# Altium schematic sheet IDE_Terminator.SchDoc: IDE Terminator
size A4; Revision: 5; SheetNumber: 3; SheetTotal: 7; Organization: Altium Limited.; Address1: Level 3, 12a Rodborough Rd; Address2: Frenchs Forest 2086; Address3: NSW; Address4: AUSTRALIA
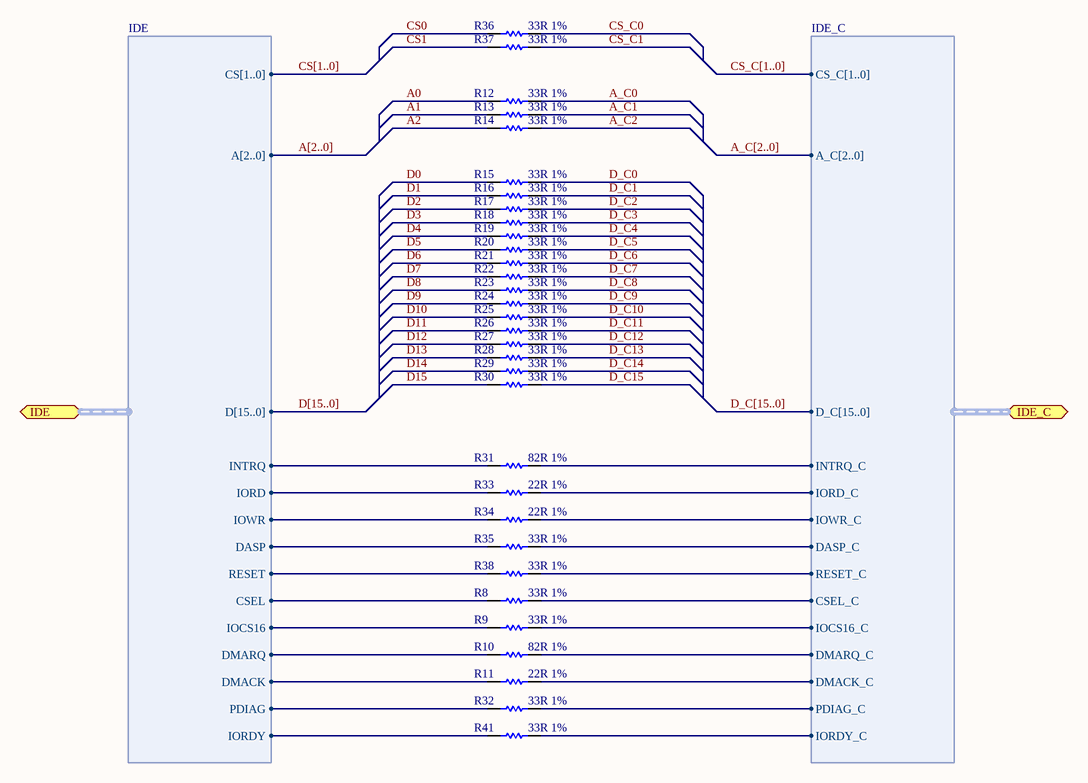
[diagram p0: IDE_Terminator.SchDoc]

## Parts
R8  33R 1%  [RESC1005-STAR]
R9  33R 1%  [RESC1005-STAR]
R10  82R 1%  [RESC1005-STAR]
R11  22R 1%  [RESC1005-STAR]
R12  33R 1%  [RESC1005-STAR]
R13  33R 1%  [RESC1005-STAR]
R14  33R 1%  [RESC1005-STAR]
R15  33R 1%  [RESC1005-STAR]
R16  33R 1%  [RESC1005-STAR]
R17  33R 1%  [RESC1005-STAR]
R18  33R 1%  [RESC1005-STAR]
R19  33R 1%  [RESC1005-STAR]
R20  33R 1%  [RESC1005-STAR]
R21  33R 1%  [RESC1005-STAR]
R22  33R 1%  [RESC1005-STAR]
R23  33R 1%  [RESC1005-STAR]
R24  33R 1%  [RESC1005-STAR]
R25  33R 1%  [RESC1005-STAR]
R26  33R 1%  [RESC1005-STAR]
R27  33R 1%  [RESC1005-STAR]
R28  33R 1%  [RESC1005-STAR]
R29  33R 1%  [RESC1005-STAR]
R30  33R 1%  [RESC1005-STAR]
R31  82R 1%  [RESC1005-STAR]
R32  33R 1%  [RESC1005-STAR]
R33  22R 1%  [RESC1005-STAR]
R34  22R 1%  [RESC1005-STAR]
R35  33R 1%  [RESC1005-STAR]
R36  33R 1%  [RESC1005-STAR]
R37  33R 1%  [RESC1005-STAR]
R38  33R 1%  [RESC1005-STAR]
R41  33R 1%  [RESC1005-STAR]

## Ports
IDE (harness IDE), IDE_C (harness IDE_C)

## Harnesses
IDE: CS[1..0], A[2..0], D[15..0], INTRQ, IORD, IOWR, DASP, RESET, CSEL, IOCS16, DMARQ, DMACK, PDIAG, IORDY
IDE_C: CS_C[1..0], A_C[2..0], D_C[15..0], INTRQ_C, IORD_C, IOWR_C, DASP_C, RESET_C, CSEL_C, IOCS16_C, DMARQ_C, DMACK_C, PDIAG_C, IORDY_C

## Nets
A0: R12.1
A1: R13.1
A2: R14.1
A_C0: R12.2
A_C1: R13.2
A_C2: R14.2
CS0: R36.1
CS1: R37.1
CS_C0: R36.2
CS_C1: R37.2
D0: R15.1
D1: R16.1
D2: R17.1
D3: R18.1
D4: R19.1
D5: R20.1
D6: R21.1
D7: R22.1
D8: R23.1
D9: R24.1
D10: R25.1
D11: R26.1
D12: R27.1
D13: R28.1
D14: R29.1
D15: R30.1
D_C0: R15.2
D_C1: R16.2
D_C2: R17.2
D_C3: R18.2
D_C4: R19.2
D_C5: R20.2
D_C6: R21.2
D_C7: R22.2
D_C8: R23.2
D_C9: R24.2
D_C10: R25.2
D_C11: R26.2
D_C12: R27.2
D_C13: R28.2
D_C14: R29.2
D_C15: R30.2
NetR8_1: R8.1 ; port IDE.CSEL
NetR8_2: R8.2 ; port IDE_C.CSEL_C
NetR9_1: R9.1 ; port IDE.IOCS16
NetR9_2: R9.2 ; port IDE_C.IOCS16_C
NetR10_1: R10.1 ; port IDE.DMARQ
NetR10_2: R10.2 ; port IDE_C.DMARQ_C
NetR11_1: R11.1 ; port IDE.DMACK
NetR11_2: R11.2 ; port IDE_C.DMACK_C
NetR31_1: R31.1 ; port IDE.INTRQ
NetR31_2: R31.2 ; port IDE_C.INTRQ_C
NetR32_1: R32.1 ; port IDE.PDIAG
NetR32_2: R32.2 ; port IDE_C.PDIAG_C
NetR33_1: R33.1 ; port IDE.IORD
NetR33_2: R33.2 ; port IDE_C.IORD_C
NetR34_1: R34.1 ; port IDE.IOWR
NetR34_2: R34.2 ; port IDE_C.IOWR_C
NetR35_1: R35.1 ; port IDE.DASP
NetR35_2: R35.2 ; port IDE_C.DASP_C
NetR38_1: R38.1 ; port IDE.RESET
NetR38_2: R38.2 ; port IDE_C.RESET_C
NetR41_1: R41.1 ; port IDE.IORDY
NetR41_2: R41.2 ; port IDE_C.IORDY_C

## Buses and harness runs
bus A[2..0]
bus A_C[2..0]
bus CS[1..0]
bus CS_C[1..0]
bus D[15..0]
bus D_C[15..0]

## Notes on the sheet
- Sheet Title
- Project Title
- Size:
- Date:
- A4
- Assy:
- Time:
- Sheet
- Revision:
- of
- File:

## Library data of the parts
R8 R9 R12-R30 R32 R35-R38 R41 = D-100-0102: Resistor, 33R 1% 0402 (1005); Power Rating: 63 mW; Category: Resistor; Mounting Technology: Surface Mount; Resistance: 33 R; Status: Production; Tolerance: 1 %
R10 R31 = D-100-0076: Resistor, 82R 1% 0402 (1005); Power Rating: 63 mW; Category: Resistor; Mounting Technology: Surface Mount; Resistance: 82 R; Status: Production; Tolerance: 1 %
R11 R33 R34 = D-100-0113: Resistor, 22R 1% 0402 (1005); Power Rating: 63 mW; Category: Resistor; Mounting Technology: Surface Mount; Resistance: 22 R; Status: Production; Tolerance: 1 %